# EAGLE design can (EAGLE 6.5.0)
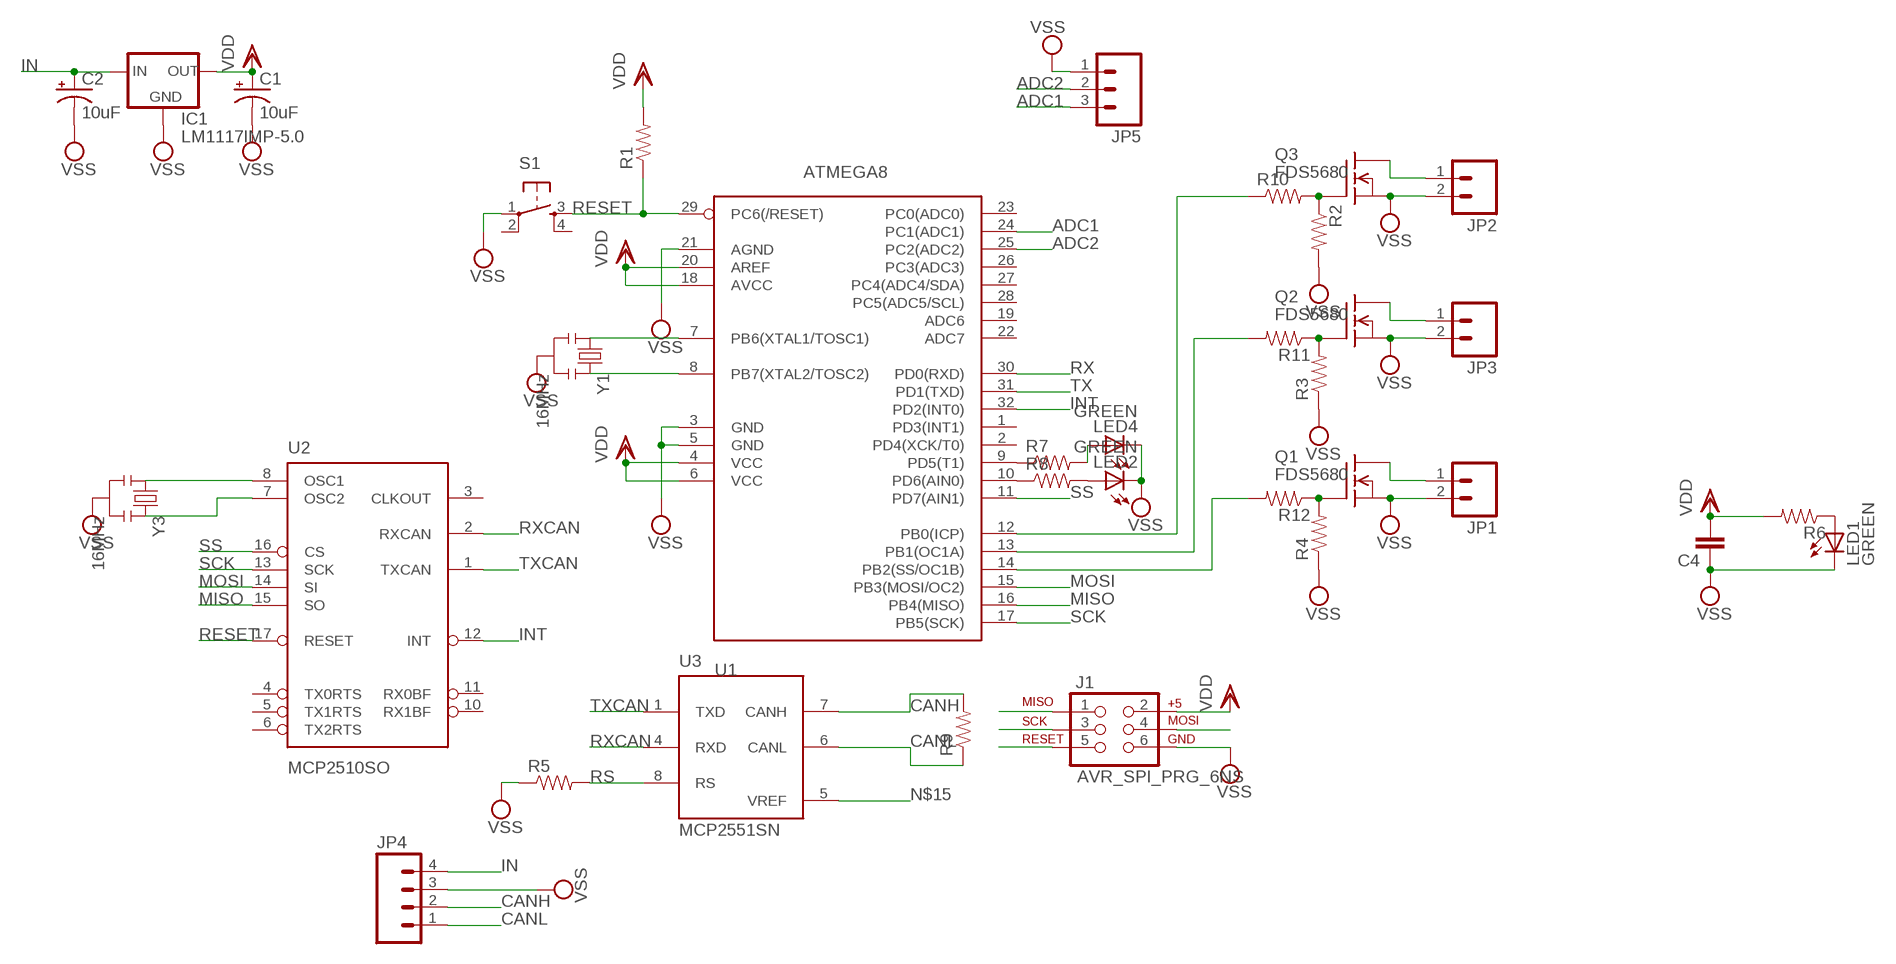
[diagram p0: schematic, sheet 1]

## Parts
C1  10uF  CAP_POL1206  [EIA3216]
C2  10uF  CAP_POL1206  [EIA3216]
C4  CAP1206  [1206]
IC1  LM1117IMP-5.0  LM1117  [SOT223]
J1  AVR_SPI_PRG_6NS  [2X3-NS]
JP1  M02PTH  [1X02]
JP2  M02PTH  [1X02]
JP3  M02PTH  [1X02]
JP4  M041X04_NO_SILK  [1X04_NO_SILK]
JP5  M03PTH  [1X03]
LED1  GREEN  LED1206  [LED-1206]
LED2  GREEN  LED1206  [LED-1206]
LED4  GREEN  LED1206  [LED-1206]
Q1  FDS5680  [SO-8]
Q2  FDS5680  [SO-8]
Q3  FDS5680  [SO-8]
R1  RESISTOR1206  [1206]
R2  RESISTOR1206  [1206]
R3  RESISTOR1206  [1206]
R4  RESISTOR1206  [1206]
R5  RESISTOR1206  [1206]
R6  RESISTOR1206  [1206]
R7  RESISTOR0805-RES  [0805]
R8  RESISTOR0805-RES  [0805]
R9  RESISTOR1206  [1206]
R10  RESISTOR1206  [1206]
R11  RESISTOR1206  [1206]
R12  RESISTOR1206  [1206]
S1  TAC_SWITCHSMD  [TACTILE_SWITCH_SMD]
U1  ATMEGA8  MEGA8-AI  [TQFP32-08]
U2  MCP2510SO  [SO-18W]
U3  MCP2551SN  [SO-08]
Y1  16MHz  RESONATOR16MHZ  [RESONATOR-SMD]
Y3  16MHz  RESONATOR16MHZ  [RESONATOR-SMD]

## Nets
ADC1: JP5.3 U1.24(PC1(ADC1))
ADC2: JP5.2 U1.25(PC2(ADC2))
CANH: JP4.2 R9.2 U3.7(CANH)
CANL: JP4.1 R9.1 U3.6(CANL)
IN: C2.A(+) IC1.3(IN) JP4.4
INT: U1.32(PD2(INT0)) U2.12(INT)
MISO: J1.1 U1.16(PB4(MISO)) U2.15(SO)
MOSI: J1.4 U1.15(PB3(MOSI/OC2)) U2.14(SI)
N$1: R8.1 U1.10(PD6(AIN0))
N$2: JP1.1 Q1.5(D) Q1.6(D) Q1.7(D) Q1.8(D)
N$3: R7.1 U1.9(PD5(T1))
N$4: Q3.4(G) R2.1 R10.2
N$5: Q2.4(G) R3.2 R11.1
N$6: JP3.1 Q2.5(D) Q2.6(D) Q2.7(D) Q2.8(D)
N$7: R12.2 U1.14(PB2(SS/OC1B))
N$8: JP2.1 Q3.5(D) Q3.6(D) Q3.7(D) Q3.8(D)
N$9: Q1.4(G) R4.2 R12.1
N$10: R11.2 U1.13(PB1(OC1A))
N$11: R10.1 U1.12(PB0(ICP))
N$12: U1.7(PB6(XTAL1/TOSC1)) Y1.1
N$13: LED1.A R6.1
N$14: U1.8(PB7(XTAL2/TOSC2)) Y1.3
N$15: U3.5(VREF)
N$16: U2.8(OSC1) Y3.1
N$17: LED2.A R8.2
N$18: LED4.A R7.2
N$19: U2.7(OSC2) Y3.3
RESET: J1.5 R1.1 S1.3 U1.29(PC6(/RESET)) U2.17(RESET)
RS: R5.2 U3.8(RS)
RX: U1.30(PD0(RXD))
RXCAN: U2.2(RXCAN) U3.4(RXD)
SCK: J1.3 U1.17(PB5(SCK)) U2.13(SCK)
SS: U1.11(PD7(AIN1)) U2.16(CS)
TX: U1.31(PD1(TXD))
TXCAN: U2.1(TXCAN) U3.1(TXD)
VDD: C1.A(+) C4.2 IC1.2(OUT) J1.2 R1.2 R6.2 U1.4(VCC) U1.6(VCC) U1.18(AVCC) U1.20(AREF)
VSS: C1.C(-) C2.C(-) C4.1 IC1.1(GND) J1.6 JP1.2 JP2.2 JP3.2 JP4.3 JP5.1 LED1.C LED2.C LED4.C Q1.1(S) Q1.2(S) Q1.3(S) Q2.1(S) Q2.2(S) Q2.3(S) Q3.1(S) Q3.2(S) Q3.3(S) R2.2 R3.1 R4.1 R5.1 S1.1 U1.3(GND) U1.5(GND) U1.21(AGND) Y1.2 Y3.2
Unconnected: S1.2 S1.4 U1.1(PD3(INT1)) U1.2(PD4(XCK/T0)) U1.19(ADC6) U1.22(ADC7) U1.23(PC0(ADC0)) U1.26(PC3(ADC3)) U1.27(PC4(ADC4/SDA)) U1.28(PC5(ADC5/SCL)) U2.3(CLKOUT) U2.4(TX0RTS) U2.5(TX1RTS) U2.6(TX2RTS) U2.10(RX1BF) U2.11(RX0BF)

## Power pins joined to a net without a drawn wire
VDD: U2.18(VDD) U3.3(VDD)
VSS: U2.9(VSS) U3.2(VSS)

## Library data of the parts
C1 C2 = SparkFun-Capacitors:CAP_POL: Capacitor Polarized These are standard SMD and PTH capacitors. Normally 10uF, 47uF, and 100uF in electrolytic and tantalum varieties. Always verify the external diameter of the through hole cap, it varies with capacity, voltage, and manufacturer. The EIA devices should be standard.
C4 = SparkFun-Capacitors:CAP: Capacitor Standard 0603 ceramic capacitor, and 0.1" leaded capacitor.
IC1 = v-reg-3:LM1117
J1 = SparkFun-Connectors:AVR_SPI_PRG_6: AVR ISP 6 Pin This is the reduced ISP connector for AVR programming. Common on Arduino. This footprint will take up less PCB space and can be used with a 10-pin to 6-pin adapter such as SKU: BOB-08508
JP1-JP3 = SparkFun-Connectors:M02: Header 2 Standard 2-pin 0.1" header. Use with straight break away headers (SKU : PRT-00116), right angle break away headers (PRT-00553), swiss pins (PRT-00743), machine pins (PRT-00117), and female headers (PRT-00115). Molex polarized connector foot print use with SKU : PRT-08233 with associated crimp pins and housings.
JP4 = SparkFun-Connectors:M04: Header 4 Standard 4-pin 0.1" header. Use with straight break away headers (SKU : PRT-00116), right angle break away headers (PRT-00553), swiss pins (PRT-00743), machine pins (PRT-00117), and female headers (PRT-00115). Molex polarized connector foot print use with SKU : PRT-08231 with associated crimp pins and housings. 1MM SMD Version SKU: PRT-10208
JP5 = SparkFun-Connectors:M03: Header 3 Standard 3-pin 0.1" header. Use with straight break away headers (SKU : PRT-00116), right angle break away headers (PRT-00553), swiss pins (PRT-00743), machine pins (PRT-00117), and female headers (PRT-00115). Molex polarized connector foot print use with SKU : PRT-08232 with associated crimp pins and housings.
LED1 LED2 LED4 = SparkFun-LED:LED: LEDs Standard schematic elements and footprints for 5mm, 3mm, 1206, and 0603 sized LEDs. 5mm - Spark Fun Electronics SKU : COM-00529 (and others)
Q1-Q3 = transistor-fet:FDS5680: 60V N-Channel PowerTrench TM MOSFET FAIRCHILD FDS5680.pdf
R1-R5 R7-R12 = SparkFun-Resistors:RESISTOR: Resistor Basic schematic elements and footprints for 0603, 1206, and PTH resistors.
R6 = SparkFun-Passives:RESISTOR: Resistor Basic schematic elements and footprints for 0603, 1206, and PTH resistors.
S1 = SparkFun-Electromechanical:TAC_SWITCH: Momentary Switch Button commonly used for reset or general input. Spark Fun Electronics SKU : COM-00097 SMT- SWCH-08247; PROD_ID: SWCH-08247
U1 = avr-7:MEGA8: MICROCONTROLLER 8 Kbytes FLASH 1 kbytes SRAM 512 bytes EEPROM USART 6-channel 10 bit ADC 2-channel 8 bit ADC
U2 = microchip_can:MCP2510
U3 = microchip_can:MCP2551: High Speed CAN tranceiver
Y1 Y3 = SparkFun-FreqCtrl:RESONATOR: Resonator Small SMD resonator. Used, eg, on the Arduino Pro/ Pro Mini boards. 8MHz- XTAL-08895 16MHz- XTAL-08900; PROD_ID: XTAL-08900

## Board
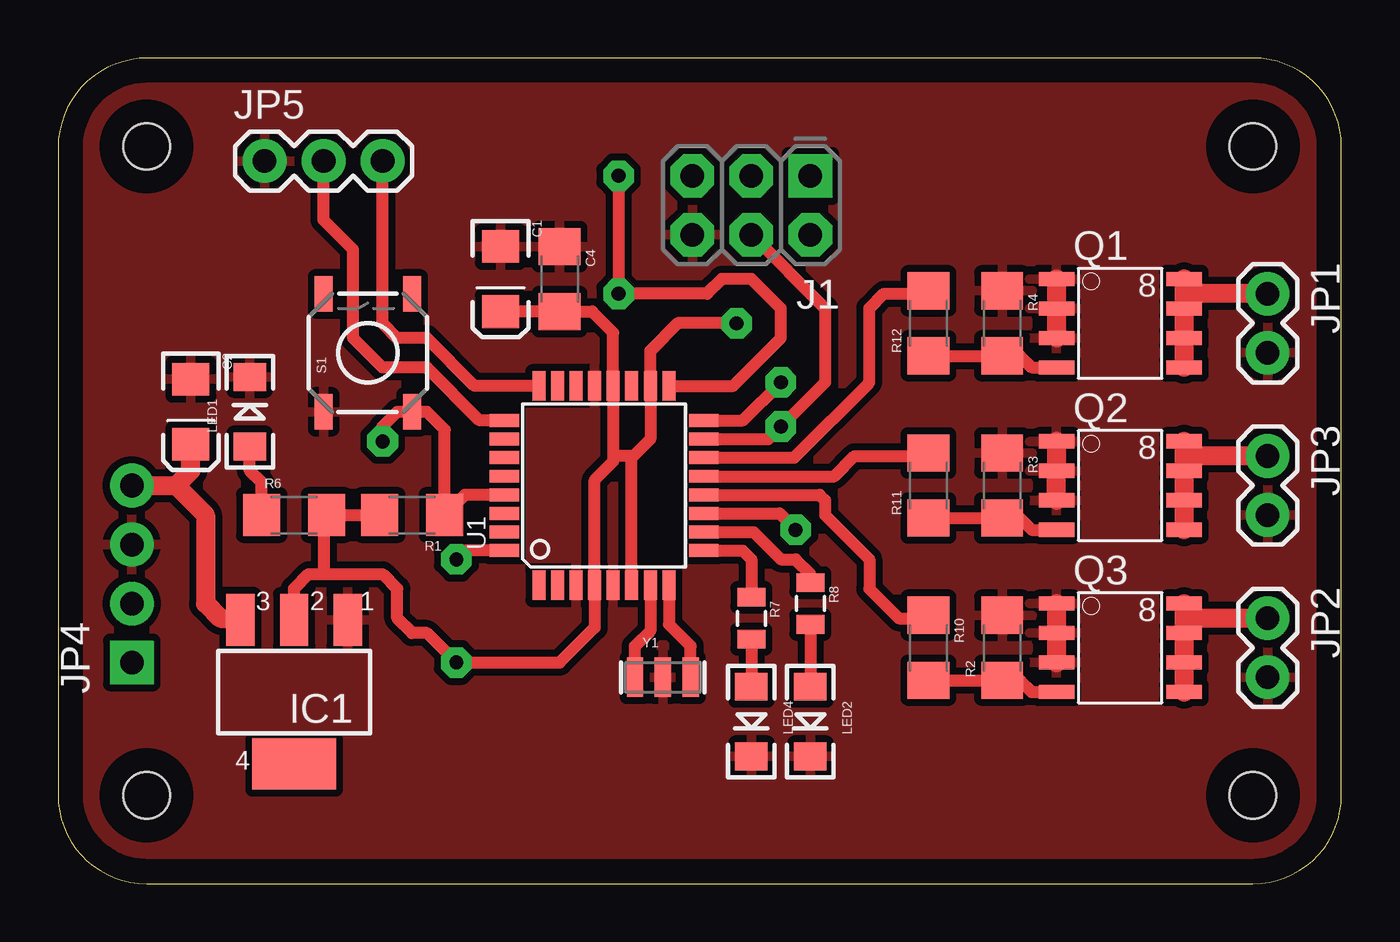
[diagram p1: board, top side]
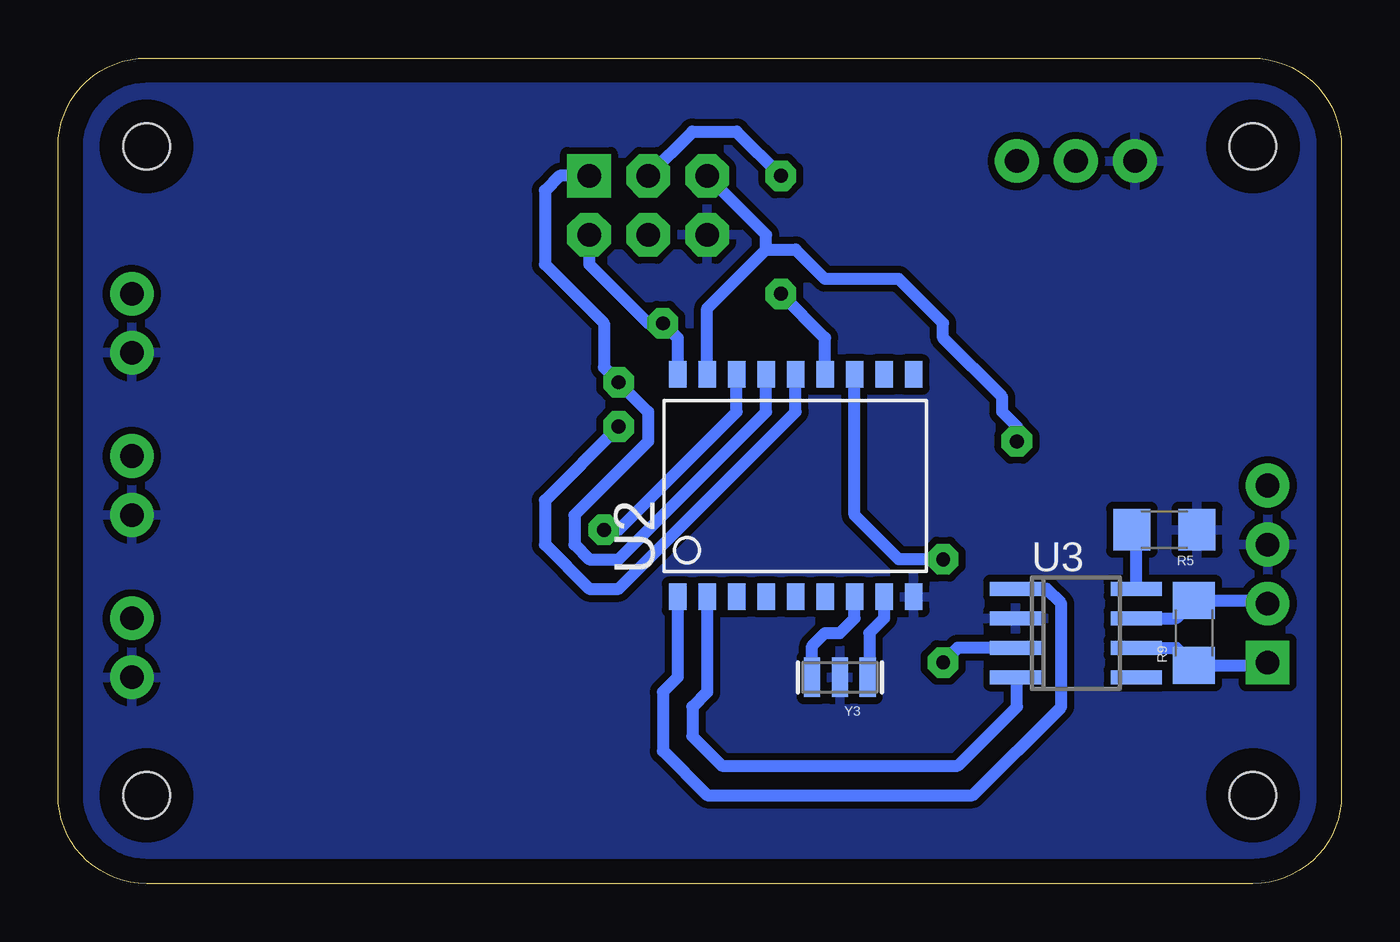
[diagram p2: board, bottom side, seen from below]

Size 55.24 x 35.55 mm. Coordinates in mm from the lower left corner, seen from the top.
Outline: 0,31.7 0,3.81 arc90 3.81,0 51.44,0 arc90 55.24,3.81 55.24,31.75 arc90 51.45,35.55 3.85,35.55 arc90 0,31.7
Copper layers (1*16): Top 0.035mm / dielectric 1.5mm / Bottom 0.035mm
Design rules "default *": minimum track width 20mil, minimum drill 24mil, track to track 12mil, track to pad 12mil, pad to pad 12mil, via to via 12mil, smd to smd 8mil, copper to edge 40mil, drill to drill 8mil, minimum pad ring 10mil, minimum via ring 8mil, stop-mask expansion 4mil, vias tented up to drill 0mil, thermal gap 12mil
Holes 2 mm at 51.44,31.75 3.81,31.75 3.81,3.81 51.44,3.81

### Footprints (pad centres in the part's own frame; a part is rotated, then mirrored left to right if it is on the bottom)
EIA3216 = smd 1.4 x 1.6: A 1.4,0; C -1.4,0
1206 = smd 1.6 x 1.8: 1 -1.4,0; 2 1.4,0
SOT223 = smd 1.219 x 2.235: 1 -2.311,-3.099; 2 0,-3.099; 3 2.311,-3.099 | smd 3.6 x 2.2: 4 0,3.099
2X3-NS = drill 1.016 pad 1.88 square: 1 -2.54,-1.27 | drill 1.016 pad 1.88 octagon: 2 -2.54,1.27; 3 0,-1.27; 4 0,1.27; 5 2.54,-1.27; 6 2.54,1.27
1X02 = drill 1.016 pad 1.88: 1 0,0; 2 2.54,0
1X04_NO_SILK = drill 1.016 pad 1.88 square: 1 0,0 | drill 1.016 pad 1.88: 2 2.54,0; 3 5.08,0; 4 7.62,0
1X03 = drill 1.016 pad 1.88: 1 0,0; 2 2.54,0; 3 5.08,0
LED-1206 = smd 1.2 x 1.4: A -1.5,0; C 1.5,0
SO-8 = smd 1.524 x 0.61: 1 -2.743,1.905; 2 -2.743,0.635; 3 -2.743,-0.635; 4 -2.743,-1.905; 5 2.743,-1.905; 6 2.743,-0.635; 7 2.743,0.635; 8 2.743,1.905
0805 = smd 0.8 x 1.2: 1 -0.9,0; 2 0.9,0
TACTILE_SWITCH_SMD = smd 1.524 x 0.762: 1 -2.54,1.905; 2 2.54,1.905; 3 -2.54,-1.905; 4 2.54,-1.905
TQFP32-08 = smd 1.27 x 0.559: 1 -4.293,2.8; 2 -4.293,2; 3 -4.293,1.2; 4 -4.293,0.4; 5 -4.293,-0.4; 6 -4.293,-1.2; 7 -4.293,-2; 8 -4.293,-2.8; 17 4.293,-2.8; 18 4.293,-2; 19 4.293,-1.2; 20 4.293,-0.4; 21 4.293,0.4; 22 4.293,1.2; 23 4.293,2; 24 4.293,2.8 | smd 0.559 x 1.27: 9 -2.8,-4.293; 10 -2,-4.293; 11 -1.2,-4.293; 12 -0.4,-4.293; 13 0.4,-4.293; 14 1.2,-4.293; 15 2,-4.293; 16 2.8,-4.293; 25 2.8,4.293; 26 2,4.293; 27 1.2,4.293; 28 0.4,4.293; 29 -0.4,4.293; 30 -1.2,4.293; 31 -2,4.293; 32 -2.8,4.293
SO-18W = smd 0.762 x 1.143: 1 -5.08,-4.788; 2 -3.81,-4.788; 3 -2.54,-4.788; 4 -1.27,-4.788; 5 0,-4.788; 6 1.27,-4.788; 7 2.54,-4.788; 8 3.81,-4.788; 9 5.08,-4.788; 10 5.08,4.788; 11 3.81,4.788; 12 2.54,4.788; 13 1.27,4.788; 14 0,4.788; 15 -1.27,4.788; 16 -2.54,4.788; 17 -3.81,4.788; 18 -5.08,4.788
SO-08 = smd 0.6 x 2.2: 1 -1.905,-2.6; 2 -0.635,-2.6; 3 0.635,-2.6; 4 1.905,-2.6; 5 1.905,2.6; 6 0.635,2.6; 7 -0.635,2.6; 8 -1.905,2.6
RESONATOR-SMD = smd 0.7 x 1.7: 1 -1.2,0; 2 0,0; 3 1.2,0

### Placement (x,y rotation side)
C1  19.05,26.04 270 top
C2  5.71,20.32 270 top
C4  21.59,26.04 270 top
IC1  10.16,8.26 180 top
J1  29.84,29.21 180 top
JP1  52.07,25.4 270 top
JP2  52.07,11.43 270 top
JP3  52.07,18.41 270 top
JP4  3.17,9.53 90 top
JP5  8.89,31.11 0 top
LED1  8.26,20.32 90 top
LED2  32.38,6.99 270 top
LED4  29.84,6.99 270 top
Q1  45.72,24.13 0 top
Q2  45.72,17.14 0 top
Q3  45.72,10.16 0 top
R1  15.24,15.88 180 top
R2  40.64,10.16 90 top
R3  40.64,17.14 270 top
R4  40.64,24.13 270 top
R5  7.62,15.24 180 bottom
R6  10.16,15.88 0 top
R7  29.84,11.43 270 top
R8  32.38,12.06 270 top
R9  6.35,10.79 90 bottom
R10  37.47,10.16 270 top
R11  37.47,17.14 90 top
R12  37.47,24.13 90 top
S1  13.34,22.86 90 top
U1  23.5,17.14 90 top
U2  23.5,17.14 0 bottom
U3  11.43,10.79 270 bottom
Y1  26.04,8.89 0 top
Y3  21.59,8.89 180 bottom

### Tracks (layer width: path | path; a pad name or v marks a point on that pad's centre or on a via)
ADC1
  Top 0.508: U1.24 17.93,21.44 15.88,23.5 14.61,23.5 13.97,24.13 JP5.3
ADC2
  Top 0.508: U1.25 18.16,19.95 15.88,22.23 13.97,22.23 12.7,23.5 12.7,27.3 11.43,28.57 JP5.2
CANH
  Bottom 0.508: U3.7 7.12,11.43 R9.2 3.31,12.2 JP4.2
CANL
  Bottom 0.508: U3.6 7.12,10.16 R9.1 3.31,9.39 JP4.1
IN
  Top 0.813: JP4.4 5.08,17.14 | 5.08,17.14 6.35,15.88 6.35,12.06 6.99,11.43 7.77,11.43 IC1.3 | 5.08,17.14 5.71,17.78 C2.A
INT  (via drill 0.6)
  Top 0.508: U1.32 17.52,14.35 v17.14,13.97
  Bottom 0.508: v17.14,13.97 19.05,13.97 20.95,15.88 U2.12
MISO  (via drill 0.6)
  Top 0.508: U1.16 29.47,19.95 v31.11,21.59
  Bottom 0.508: U2.15 24.77,20.32 31.11,13.97 32.38,13.97 33.02,14.61 33.02,15.88 29.84,19.05 29.84,20.32 v31.11,21.59 31.75,22.23 31.75,24.13 34.29,26.67 34.29,29.84 33.66,30.48 J1.1
MOSI  (via drill 0.6)
  Top 0.508: U1.15 30.57,19.14 v31.11,19.68 33.02,21.59 33.02,24.77 J1.4
  Bottom 0.508: v31.11,19.68 34.29,16.51 34.29,14.61 32.38,12.7 31.11,12.7 23.5,20.32 U2.14
N$1
  Top 0.508: U1.10 29.94,15.14 31.11,13.97 31.75,13.97 32.38,13.34 R8.1
N$2
  Top 0.813: Q1.8 48.46,25.4 | 48.46,25.4 Q1.7 Q1.6 Q1.5 | JP1.1 48.46,25.4
N$3
  Top 0.508: U1.9 29.47,14.35 29.84,13.97 R7.1
N$4
  Top 0.508: R10.2 R2.1 41.41,8.76 41.91,8.26 Q3.4
N$5
  Top 0.508: R11.1 R3.2 41.41,15.74 41.91,15.24 Q2.4
N$6
  Top 0.813: Q2.8 48.46,18.41 | 48.46,18.41 Q2.7 Q2.6 Q2.5 | JP3.1 48.46,18.41
N$7
  Top 0.508: U1.14 31.68,18.34 34.92,21.59 34.92,24.77 35.56,25.4 37.34,25.4 R12.2
N$8
  Top 0.813: Q3.8 48.46,11.43 | 48.46,11.43 Q3.7 Q3.6 Q3.5 | JP2.1 48.46,11.43
N$9
  Top 0.508: R12.1 R4.2 41.41,22.73 41.91,22.23 Q1.4
N$10
  Top 0.508: U1.13 33.42,17.55 34.29,18.41 37.34,18.41 R11.2
N$11
  Top 0.508: U1.12 32.78,16.75 33.02,16.51 33.02,15.88 34.92,13.97 34.92,12.7 36.2,11.43 37.34,11.43 R10.1
N$12
  Top 0.508: Y1.1 24.84,10.23 25.5,10.89 U1.7
N$13
  Top 0.508: R6.1 8.76,17.27 8.26,17.78 LED1.A
N$14
  Top 0.508: Y1.3 27.23,10.23 26.3,11.17 U1.8
N$16
  Bottom 0.508: U2.8 19.68,11.43 20.32,10.79 20.32,8.96 Y3.1
N$17
  Top 0.508: R8.2 LED2.A
N$18
  Top 0.508: R7.2 LED4.A
N$19
  Bottom 0.508: Y3.3 22.79,10.23 22.23,10.79 21.59,10.79 20.95,11.43 U2.7
RESET  (via drill 0.6)
  Top 0.508: v13.97,19.05 13.97,19.68 14.61,20.32 S1.3 15.88,20.32 16.64,19.55 R1.1 17.51,16.75 U1.29
  Bottom 0.508: U2.17 27.3,24.77 24.77,27.3 | 24.77,27.3 23.5,27.3 22.23,26.04 19.05,26.04 17.14,24.13 17.14,23.5 14.61,20.95 14.61,20.32 13.97,19.68 v13.97,19.05 | 24.77,27.3 24.77,27.94 J1.5
RS
  Bottom 0.508: U3.8 8.83,15.05 R5.2
RXCAN
  Bottom 0.508: U2.2 27.3,8.26 27.94,7.62 27.94,6.35 26.67,5.08 16.51,5.08 13.97,7.62 13.97,8.83 U3.4
SCK  (via drill 0.6)
  Top 0.508: U1.17 29.06,21.44 31.11,23.5 31.11,24.77 29.84,26.04 28.57,26.04 27.94,25.4 v24.13,25.4 v24.13,30.48
  Bottom 0.508: U2.13 22.23,23.5 v24.13,25.4 | J1.3 27.94,32.38 26.04,32.38 v24.13,30.48
SS  (via drill 0.6)
  Top 0.508: U1.11 31.05,15.95 v31.75,15.24
  Bottom 0.508: v31.75,15.24 31.11,15.24 26.04,20.32 U2.16
TXCAN
  Bottom 0.508: U2.1 28.57,8.89 29.21,8.26 29.21,5.71 27.3,3.81 15.88,3.81 12.06,7.62 12.06,12.06 12.7,12.7 U3.1
VDD  (via drill 0.6)
  Top 0.508: 23.89,18.41 U1.20 23.89,23.73 22.99,24.64 C4.2 C1.A | 23.89,18.41 23.89,18.18 23.09,17.38 U1.4 23.09,11.03 21.59,9.53 v17.14,9.53 15.88,10.79 15.24,10.79 14.61,11.43 14.61,12.7 13.97,13.34 11.43,13.34 | 24.77,18.41 25.5,19.14 U1.18 25.5,22.95 26.67,24.13 v29.21,24.13 | 24.77,18.41 23.89,18.41 | U1.6 24.7,18.34 24.77,18.41 | R1.2 R6.2 11.43,15.74 11.43,13.34 | IC1.2 10.16,12.7 10.79,13.34 11.43,13.34
  Bottom 0.508: J1.2 32.38,26.67 29.84,24.13 v29.21,24.13 28.57,23.5 U2.18 | U3.3 16.51,10.16 v17.14,9.53
VSS
  Top 0.813: Q1.1 Q1.2 Q1.3 | Q2.1 Q2.2 Q2.3 | Q3.1 Q3.2 Q3.3
  pour Top: 51.44,34.29 3.81,34.29 arc90 1.27,31.75 1.27,3.81 arc90 3.81,1.27 51.44,1.27 arc90 53.98,3.81 53.98,31.75 arc90
  pour Bottom: 51.44,34.29 3.81,34.29 arc90 1.27,31.75 1.27,3.81 arc90 3.81,1.27 51.44,1.27 arc90 53.98,3.81 53.98,31.75 arc90